# Altium schematic sheet Buck 5-12V.SchDoc
size 420 x 297 mm; SheetNumber: 6; SheetTotal: 15
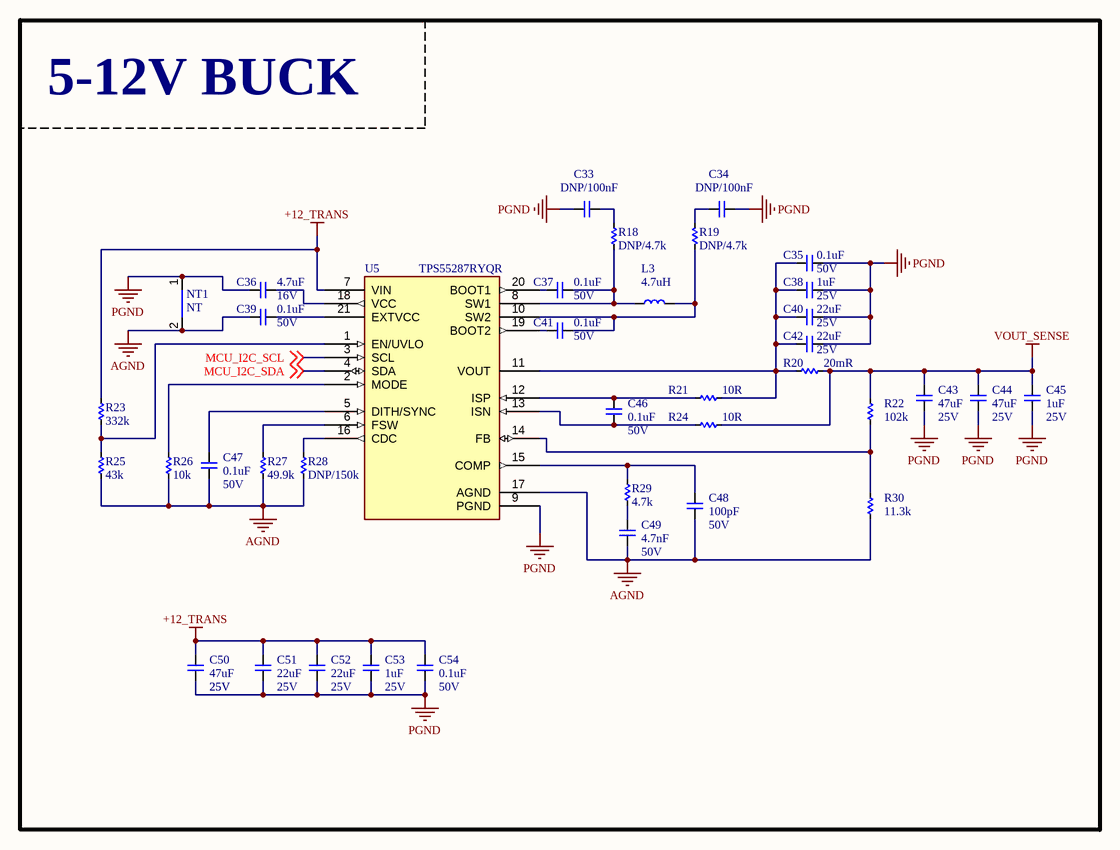
[diagram p0: Buck 5-12V.SchDoc]

## Parts
C33  DNP/100nF  [CAP_C_2012X110]
C34  DNP/100nF  [CAP_C_2012X110]
C35  0.1uF  Voltage: 50V  [CAP_C_1608X80]
C36  4.7uF  Voltage: 16V  [CAP_C_1608X80]
C37  0.1uF  Voltage: 50V  [CAP_C_1608X80]
C38  1uF  Voltage: 25V  [CAP_C_1608X80]
C39  0.1uF  Voltage: 50V  [CAP_C_1608X80]
C40  22uF  Voltage: 25V  [CAP_C_2012X110]
C41  0.1uF  Voltage: 50V  [CAP_C_1608X80]
C42  22uF  Voltage: 25V  [CAP_C_2012X110]
C43  47uF  Voltage: 25V  [CAP_C_3225X80]
C44  47uF  Voltage: 25V  [CAP_C_3225X80]
C45  1uF  Voltage: 25V  [CAP_C_1608X80]
C46  0.1uF  Voltage: 50V  [CAP_C_1608X80]
C47  0.1uF  Voltage: 50V  [CAP_C_1608X80]
C48  100pF  Voltage: 50V  [CAP_C_1608X80]
C49  4.7nF  Voltage: 50V  [CAP_C_1608X80]
C50  47uF  Voltage: 25V  [CAP_C_3225X80]
C51  22uF  Voltage: 25V  [CAP_C_2012X110]
C52  22uF  Voltage: 25V  [CAP_C_2012X110]
C53  1uF  Voltage: 25V  [CAP_C_1608X80]
C54  0.1uF  Voltage: 50V  [CAP_C_1608X80]
L3  4.7uH  [Inductor SMD 6x5.7x5]
NT1  NT  [NETTIE_SMD]  (net tie)
R18  DNP/4.7k  [RES_C_3216X70]
R19  DNP/4.7k  [RES_C_3216X70]
R20  20mR  [RES_C_3216X70]
R21  10R  [RES_C_1608X60]
R22  102k  [RES_C_1608X60]
R23  332k  [RES_C_1608X60]
R24  10R  [RES_C_1608X60]
R25  43k  [RES_C_1608X60]
R26  10k  [RES_C_1608X60]
R27  49.9k  [RES_C_1608X60]
R28  DNP/150k  [RES_C_1608X60]
R29  4.7k  [RES_C_1608X60]
R30  11.3k  [RES_C_1608X60]
U5  TPS55287RYQR  [VQFN_TPS]

## Nets
+12_TRANS: C50.2 C51.2 C52.2 C53.2 C54.2 R23.2 U5.7(VIN)
AGND: C39.1 C47.1 C48.1 C49.1 NT1.2 R25.2 R26.1 R27.1 R28.1 R30.1 U5.17(AGND)
PGND: C33.2 C34.2 C35.1 C36.1 C38.1 C40.1 C42.1 C43.1 C44.1 C45.1 C50.1 C51.1 C52.1 C53.1 C54.1 NT1.1 U5.9(PGND)
VOUT_SENSE: C43.2 C44.2 C45.2 R20.1 R22.2 R24.1
MCU_I2C_SCL: U5.3(SCL) ; off-sheet MCU_I2C_SCL
MCU_I2C_SDA: U5.4(SDA) ; off-sheet MCU_I2C_SDA
NetC33_1: C33.1 R18.1
NetC34_1: C34.1 R19.2
NetC35_2: C35.2 C38.2 C40.2 C42.2 R20.2 R21.1 U5.11(VOUT)
NetC36_2: C36.2 U5.18(VCC)
NetC37_1: C37.1 L3.1 R18.2 U5.8(SW1)
NetC37_2: C37.2 U5.20(BOOT1)
NetC39_2: C39.2 U5.21(EXTVCC)
NetC41_1: C41.1 L3.2 R19.1 U5.10(SW2)
NetC41_2: C41.2 U5.19(BOOT2)
NetC46_1: C46.1 R21.2 U5.12(ISP)
NetC46_2: C46.2 R24.2 U5.13(ISN)
NetC47_2: C47.2 U5.5(DITH/SYNC)
NetC48_2: C48.2 R29.2 U5.15(COMP)
NetC49_2: C49.2 R29.1
NetR22_1: R22.1 R30.2 U5.14(FB)
NetR23_1: R23.1 R25.1 U5.1(EN/UVLO)
NetR26_2: R26.2 U5.2(MODE)
NetR27_2: R27.2 U5.6(FSW)
NetR28_2: R28.2 U5.16(CDC)

## Notes on the sheet
- 5-12V BUCK
- (near C50) 25V
- Project:
- DAL_PDU
- Sub-system:
- IGRVT-50
- Design by:
- KIEN HOANG
- BAO BUI
- Sheet title:
- Sheet
- A3
- of
- Checked by:
- Approved by:
- VU PHAM
- Revision:
- Document No:
- Size:
- Date:

## Library data of the parts
C33-C54 = _CAP_C_2: CAP
L3 = Inductor
NT1 = NetTie_SMD: Net Tie SMD
R18-R30 = _RES_B_2_2: RES
U5 = TPS55289-Q1